# EAGLE design main (EAGLE 7.5.0)
COMPANY: ADAFRUIT INDUSTRIES; DRAWN: KTOWN; REV: B
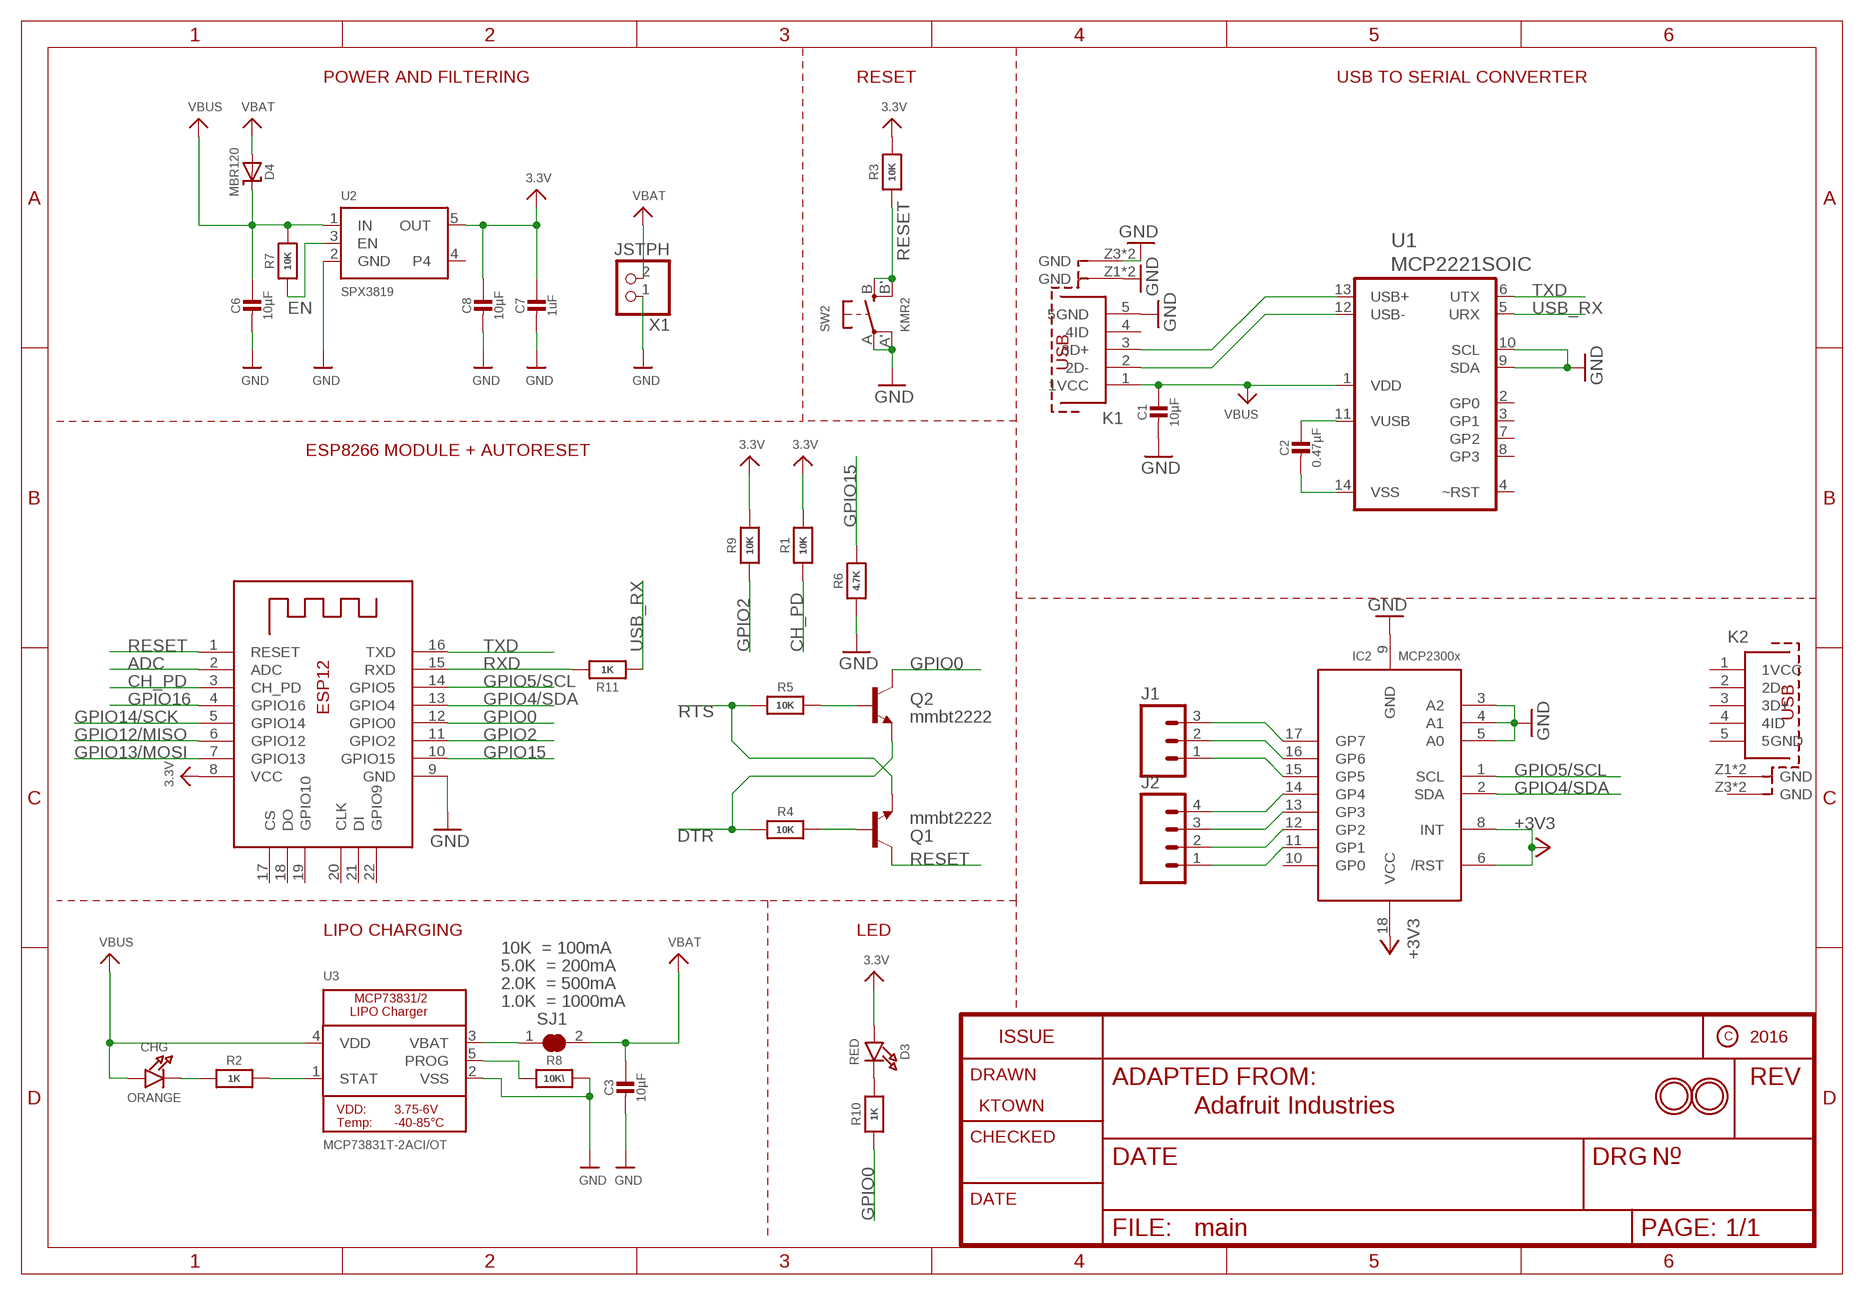
[diagram p0: schematic, sheet 1]
FRAME1 (FRAME_A4): COMPANY: Bilal Mahmoud; REV: .1

## Parts
C1  10µF  CAP_CERAMIC0805-NOOUTLINE  [0805-NO]
C2  0.47µF  CAP_CERAMIC0805-NOOUTLINE  [0805-NO]
C3  10µF  CAP_CERAMIC0805-NOOUTLINE  [0805-NO]
C6  10µF  CAP_CERAMIC0805-NOOUTLINE  [0805-NO]
C7  1uF  CAP_CERAMIC0603_NO  [0603-NO]
C8  10µF  CAP_CERAMIC0805-NOOUTLINE  [0805-NO]
CHG  ORANGE  LED0805_NOOUTLINE  [CHIPLED_0805_NOOUTLINE]
D3  RED  LED0805_NOOUTLINE  [CHIPLED_0805_NOOUTLINE]
D4  MBR120  DIODE-SCHOTTKYSOD-123  [SOD-123]
IC2  MCP23008/SO  [SO18W]
J1  M031X03_NO_SILK  [1X03_NO_SILK]
J2  M04NO_SILK_ALL_ROUND  [1X04_NO_SILK_ALL_ROUND]
K1  629105150521  [629105150521]
K2  629105150521  [629105150521]
Q1  mmbt2222  TRANSISTOR_NPNSOT23-3  [SOT23-3]
Q2  mmbt2222  TRANSISTOR_NPNSOT23-3  [SOT23-3]
R1  10K  RESISTOR_0603_NOOUT  [0603-NO]
R2  1K  RESISTOR_0603_NOOUT  [0603-NO]
R3  10K  RESISTOR_0603_NOOUT  [0603-NO]
R4  10K  RESISTOR_0603_NOOUT  [0603-NO]
R5  10K  RESISTOR_0603MP  [_0603MP]
R6  4.7K  RESISTOR_0603_NOOUT  [0603-NO]
R7  10K  RESISTOR_0603_NOOUT  [0603-NO]
R8  10K\  RESISTOR_0603_NOOUT  [0603-NO]
R9  10K  RESISTOR_0603_NOOUT  [0603-NO]
R10  1K  RESISTOR_0603_NOOUT  [0603-NO]
R11  1K  RESISTOR_0603MP  [_0603MP]
SJ1  SOLDERJUMPER_CLOSED  [SOLDERJUMPER_CLOSEDWIRE]
SW2  KMR2  SWITCH_TACT_SMT4.6X2.8  [BTN_KMR2_4.6X2.8]
U1  MCP2221SOIC  [SOIC14]
U2  SPX3819  VREG_SOT23-5  [SOT23-5]
U3  MCP73831T-2ACI/OT  MCP73831/2  [SOT23-5]
U$31  MOUNTINGHOLE2.5  [MOUNTINGHOLE_2.5_PLATED]
U$32  MOUNTINGHOLE2.5  [MOUNTINGHOLE_2.5_PLATED]
X1  JSTPH  CON_JST_PH_2PIN  [JSTPH2]
X2  ESP-12  ESP-12E  [ESP-12E]

## Nets
3.3V: C7.1 C8.1 D3.A R1.2 R3.2 R9.2 U2.5(OUT) X2.8(VCC)
+3V3: IC2.6(/RST) IC2.8(INT) IC2.18(VCC)
ADC: X2.2(ADC)
CH_PD: R1.1 X2.3(CH_PD)
DTR: Q2.2(E) R4.1
EN: R7.1 U2.3(EN)
GND: C1.2 C3.2 C6.2 C7.2 C8.2 IC2.3(A2) IC2.4(A1) IC2.5(A0) IC2.9(GND) K1.5(5GND) K1.Z1(GND) K1.Z2(GND) K1.Z3(GND) K1.Z4(GND) R6.1 R8.2 SW2.A'(P1) SW2.A(P) U1.9(SDA) U1.10(SCL) U2.2(GND) U3.2(VSS) X1.1 X2.9(GND)
GPIO0: Q2.3(C) R10.1 X2.12(GPIO0)
GPIO2: R9.1 X2.11(GPIO2)
GPIO4/SDA: IC2.2(SDA) X2.13(GPIO4)
GPIO5/SCL: IC2.1(SCL) X2.14(GPIO5)
GPIO12/MISO: X2.6(GPIO12)
GPIO13/MOSI: X2.7(GPIO13)
GPIO14/SCK: X2.5(GPIO14)
GPIO15: R6.2 X2.10(GPIO15)
GPIO16: X2.4(GPIO16)
N$1: CHG.C R2.1
N$2: C2.1 U1.11(VUSB)
N$3: R2.2 U3.1(STAT)
N$4: R8.1 U3.5(PROG)
N$5: D3.C R10.2
N$6: C2.2 U1.14(VSS)
N$7: SJ1.1 U3.3(VBAT)
N$8: K1.3(3D+) U1.13(USB+)
N$9: IC2.17(GP7) J1.3
N$10: IC2.16(GP6) J1.2
N$11: IC2.15(GP5) J1.1
N$12: Q1.1(B) R4.2
N$13: Q2.1(B) R5.2
N$14: IC2.14(GP4) J2.4
N$15: IC2.13(GP3) J2.3
N$16: IC2.12(GP2) J2.2
N$17: IC2.11(GP1) J2.1
N$18: K1.2(2D-) U1.12(USB-)
RESET: Q1.3(C) R3.1 SW2.B'(S1) SW2.B(S) X2.1(RESET)
RTS: Q1.2(E) R5.1
RXD: R11.2 X2.15(RXD)
TXD: U1.6(UTX) X2.16(TXD)
USB_RX: R11.1 U1.5(URX)
VBAT: C3.1 D4.A SJ1.2 X1.2
VBUS: C1.1 C6.1 CHG.A D4.C K1.1(1VCC) R7.2 U1.1(VDD) U2.1(IN) U3.4(VDD)
Unconnected: IC2.10(GP0) K1.4(4ID) K2.1(1VCC) K2.2(2D-) K2.3(3D+) K2.4(4ID) K2.5(5GND) K2.Z1(GND) K2.Z2(GND) K2.Z3(GND) K2.Z4(GND) U1.2(GP0) U1.3(GP1) U1.4(~RST) U1.7(GP2) U1.8(GP3) U2.4 X2.17(CS) X2.18(DO) X2.19(GPIO10) X2.20(CLK) X2.21(DI) X2.22(GPIO9)

## Notes on the sheet
- POWER AND FILTERING | RESET | USB TO SERIAL CONVERTER
- ESP8266 MODULE + AUTORESET
- LIPO CHARGING | LED
- 10K  = 100mA
- 5.0K  = 200mA
- 2.0K  = 500mA
- 1.0K  = 1000mA

## Library data of the parts
C1-C3 C6-C8 = microbuilder:CAP_CERAMIC: Ceramic Capacitors For new designs, use the packages preceded by an '_' character since they are more reliable: The following footprints should be used on most boards: _0402 - Standard footprint for regular board layouts _0603 - Standard footprint for regular board layouts _0805 - Standard footprint for regular board layouts _1206 - Standard footprint for regular board layouts For extremely tight-pitch boards where space is at a premium, the following 'micro-pitch' footprints can be used (smaller pads, no silkscreen outline, etc.): _0402MP - Micro-pitch footprint for very dense/compact boards _0603MP - Micro-pitch footprint for very dense/compact boards _0805MP - Micro-pitch footprint for very dense/compact boards _1206MP - Micro-pitch footprint for very dense/compact boards
CHG D3 = microbuilder:LED: LED 0603 - 0603 Surface Mount Package 2mA: Green LED - Low Power (3.9mcd, 2ma, 1.7Vf) - Digikey: 475-2709-2-ND Orange LED - Low Power (9.8mcd, 2ma, 1.8Vf) - Digikey: 475-1194-2-ND Red LED - Low Power (5mcd, 2ma, 1.8Vf) - Digikey: 475-1195-2-ND Yellow LED - Low Power (7mcd, 2ma, 1.8Vf) - Digikey: 475-1196-2-ND 5mA: Blue LED - Low Power (17mcd, 5ma, 2.9Vf) - Digikey: LNJ937W8CRACT-ND 0805 - 0805 Surface Mount Package 2mA: Red LED (8.8mcd, 2mA, 1.8Vf, Clear) - Low Power [Digikey: 475-2510-1-ND] Green LED (5mcd, 2mA, 1.8Vf, Clear) - Low Power [Digikey: 475-2730-1-ND] Yellow LED (11.3mcd, 2mA, 1.8Vf, Clear) - Low Power [Digikey: 475-2555-1-ND] 20mA: Red LED (104mcd, 20mA, Diffused) - LS R976 [Digikey: 475-1278-6-ND] Red LED (12mcd, 20mA, 2.0Vf, Clear) - APT2012EC [Digikey: 754-1128-1-ND] Green LED (15mcd, 20mA, 2.2Vf, Clear) - APT2012GC [Digikey: 754-1131-1-ND] Orange LED (160mcd, 20mA, 2.1Vf, Clear) - APT2012SECK [Digikey: 754-1130-1-ND] 1206 - 1206 Surface Mount Package Green LED (26mcd, 20mA, Diffused) - LG N971 [Digikey: 475-1407-6-ND] Red LED (15mcd, 20mA, Diffused) - LH N974 [Digikey: 475-1416-6-ND] Cree - Cree High-Power Surface Mount LEDs XPEBWT-L1-0000-00D50 - White 111lm 350mA 2.9Vf 6200K 110° XTEAWT-00-0000-00000LEE3 - White 114lm 350mA 2.85Vf 5000K 115° Everlight - Everlight 45-21 Series Surface Mount LEDs 45-21/QK2C-B2832AC2CB2/2T - Warm White 2000mcd 20mA 3.25Vf 3050K 120° 45-21/LK2C-B38452C4CB2/2T - Nuetral White 2000mcd 20mA 3.25Vf 4150K 120° 45-21/LK2C-B50634C6CB2/2T - Cold White 2200mcd 20mA 3.25Vf 5650K 120° PLCC2 Reverse Mount LS T77K-J1L2-1-0-2-R18-Z - Red 11.25mcd 2mA 1.8Vf 630nm 120° LO T77K-L1M2-24-Z - Orange 19.6mcd 2mA 1.8Vf 606nm 120° LY T77K-K2M1-26-Z - Yellow 15.7mcd 2mA 1.8Vf 587nm 120°
D4 = microbuilder:DIODE-SCHOTTKY
IC2 = adafruit:MCP23008: MCP23008 Inexpensive i2c i/o expander - 8 general purpose i/o pins with optional pullups
J1 = SparkFun-Connectors:M03: Header 3 Standard 3-pin 0.1" header. Use with straight break away headers (SKU : PRT-00116), right angle break away headers (PRT-00553), swiss pins (PRT-00743), machine pins (PRT-00117), and female headers (PRT-00115). Molex polarized connector foot print use with SKU : PRT-08232 with associated crimp pins and housings.
J2 = SparkFun-Connectors:M04: Header 4 Standard 4-pin 0.1" header. Use with straight break away headers (SKU : PRT-00116), right angle break away headers (PRT-00553), swiss pins (PRT-00743), machine pins (PRT-00117), and female headers (PRT-00115). Molex polarized connector foot print use with SKU : PRT-08231 with associated crimp pins and housings. 1MM SMD Version SKU: PRT-10208; PROD_ID: CONN-09696
K1 K2 = Input-Output_Connectors_rev15d:629105150521: WR-COM_USB_Micro Type B_Horizontal_SMT ; Micro Type B Horizontal SMT - 3A current at Pin1 & Pin 5 - with Pegs and THT shielding Pins - T&R Packaging Code : Con_I-O_COM_USB_2.0_B_629105150521_629105150521 <http://katalog.we-online.de/media/images/eican/Con_I-O_COM_USB_2.0_B_629105150521_pf2.jpg> Details see: http://katalog.we-online.de/em/datasheet/629105150521.pdf Created 12/08/2014, Dan Xu 2014 (C) Wurth Elektronik
Q1 Q2 = SparkFun:TRANSISTOR_NPN: Transistor NPN BJT configuration in SOT23 package. MMBT2222 is the common NPN we use. Double check BCE configuration again layout.
R1-R11 = microbuilder:RESISTOR: Resistors For new designs, use the packages preceded by an '_' character since they are more reliable: The following footprints should be used on most boards: _0402 - Standard footprint for regular board layouts _0603 - Standard footprint for regular board layouts _0805 - Standard footprint for regular board layouts _1206 - Standard footprint for regular board layouts For extremely tight-pitch boards where space is at a premium, the following 'micro-pitch' footprints can be used (smaller pads, no silkscreen outline, etc.): _0402MP - Micro-pitch footprint for very dense/compact boards _0603MP - Micro-pitch footprint for very dense/compact boards _0805MP - Micro-pitch footprint for very dense/compact boards _1206MP - Micro-pitch footprint for very dense/compact boards
SJ1 = microbuilder:SOLDERJUMPER_CLOSED: Solder Jumper - Closed These solder jumpers are closed by default CLOSEDWIRE - 10 mil trace between pads that can be cut and resoldered later CLOSEDPERM - 63 mil trace between pads for a permanent connection (used to 'bridge' two signals, a shameless hack for Eagle). Can double as a test point as well (no cream layer)
SW2 = microbuilder:SWITCH_TACT_SMT: SMT Tact Switches 6x6mm - Digikey: P12940SCT-ND KMR2 (4.6x2.8mm) - Digikey: 401-1426-1-ND EVQ-PQHB55 - Light Touch, 160GF (4.5x4.5mm) - Digikey: P8090SCT-ND KMT0 - KMT021 NGJ LHS (etc.) IP68/Waterproof - Digikey: CKN10289CT-ND
U1 = mcp2221:MCP2221
U2 = microbuilder:VREG_SOT23-5: SOT23-5 Fixed Voltage Regulators Part Current Out V Out V In V Dropout ?JA (°C/W) TJ (°C) Digikey Part No. ADP121 150mA 3.3V 3.4-5.5V 0.09V @ 150mA -- -- ADP121-AUJZ33R7CT-ND ADP121 150mA 3.0V 3.1-5.5V 0.09V @ 150mA -- -- ADP121-AUJZ30R7CT-ND ADP122 300mA 3.3V 3.4-5.5V 0.085V @ 300mA -- -- ADP122AUJZ-3.3-R7CT-ND ADP1712 300mA 3.3V 3.5-5.5V 0.17V @ 300mA -- -- ADP1712AUJZ-3.3-R7TR-ND AP7311 (Low Cost) 150mA 3.3V 3.5-6V 0.15V @ 150mA -- -- AP7311-33WG-7DICT-ND LD39015M18R 150mA 1.8V 1.9V-5.5V 0.08V @ 100mA -- -- 497-6977-1-ND LP2985A-33DBVR 150mA 3.3V 3.3-16V 0.28V @ 150mA 206 150 296-18479-1-ND MCP1824T-3302E/OT 300mA 3.3V 3.5V-6V 0.2V @ 300mA -- -- MCP1824T-3302E/OTCT-ND MIC5205-2.5YM5 TR 150mA 2.5V 2.7-16V 0.165V @ 150mA -- -- 576-1257-2-ND MIC5205-3.0YM5 TR 150mA 3.0V 3.2V-16V 0.165V @ 150mA -- -- 576-1258-2-ND MIC5205-3.3YM5 TR 150mA 3.3V 3.5V-16V 0.165V @ 150mA -- -- 576-1259-2-ND TPS780330220 150mA 3.3V+2.2V 3.6-5.5V 250mV Max -- -- 296-23332-1-ND TDA3663/N1,135 100mA 3.3V 3.5-45V 0.18V @ 50mA -- -- 568-5343-1-ND Max operating temp can be calculated using ?JA, TJ (max junction temperature), and power in watts. Set the "Maximum Ambient Temperature" until it reaches TJ ("Max Junction Temperature"), which is the absolute limit for safe use of the regulator: Heat Sink Temperature Calculator <http://www.daycounter.com/Calculators/Heat-Sink-Temperature-Calculator.phtml> For example, With 12V source into a 3.3V LP2985 and a 30mA load, we are dissipating (12V-3.3V) * 0.03A = 0.261W. With a ?JA of 206 °C/W, a TJ of 150°C, and 261mW we can safely use the chip without a heat sink up to 75°C (=147.1°C Junction Temperature).
U3 = microbuilder:MCP73831/2: MCP73831/2 LIPO Charger VDD: 3.75 - 6V Temp -40 - 85°C Programmable Charge Rate: 15-500mA NOTE: STAT is a tri-state logic output on the MCP73831 and an open-drain output on the MCP73832. SOT23-5 with 4.2V output and tri-state logic on STAT = MCP73831T-2ACI/OT
U$31 U$32 = microbuilder:MOUNTINGHOLE: Mounting Hole For #2 screws (0.086"/2.18mm width, 0.094"/2.4mm hole) use 2.5mm; BOM: EXCLUDE
X1 = microbuilder:CON_JST_PH_2PIN: JST 2-Pin Right-Angle Connector PH-Series - 4UConnector: 17311 SH-Series - 4UConnector: 07278
X2 = microbuilder:ESP-12E

## Board
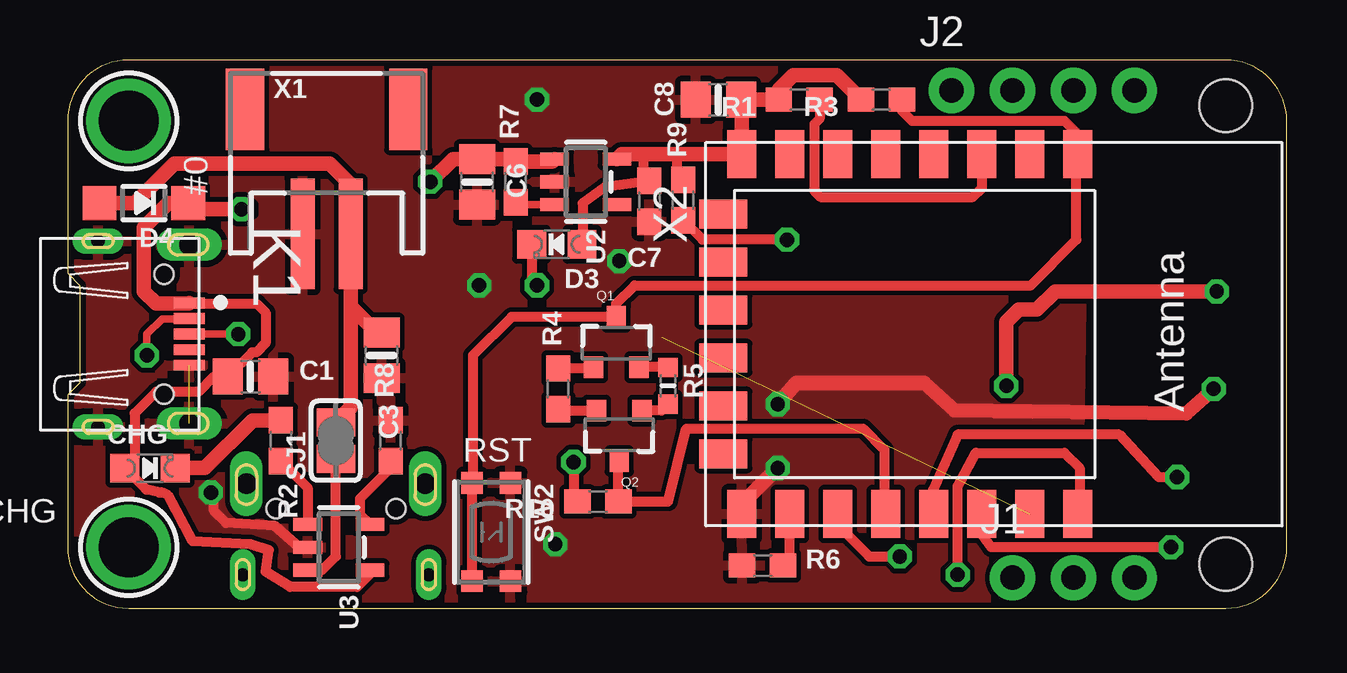
[diagram p1: board, top side]
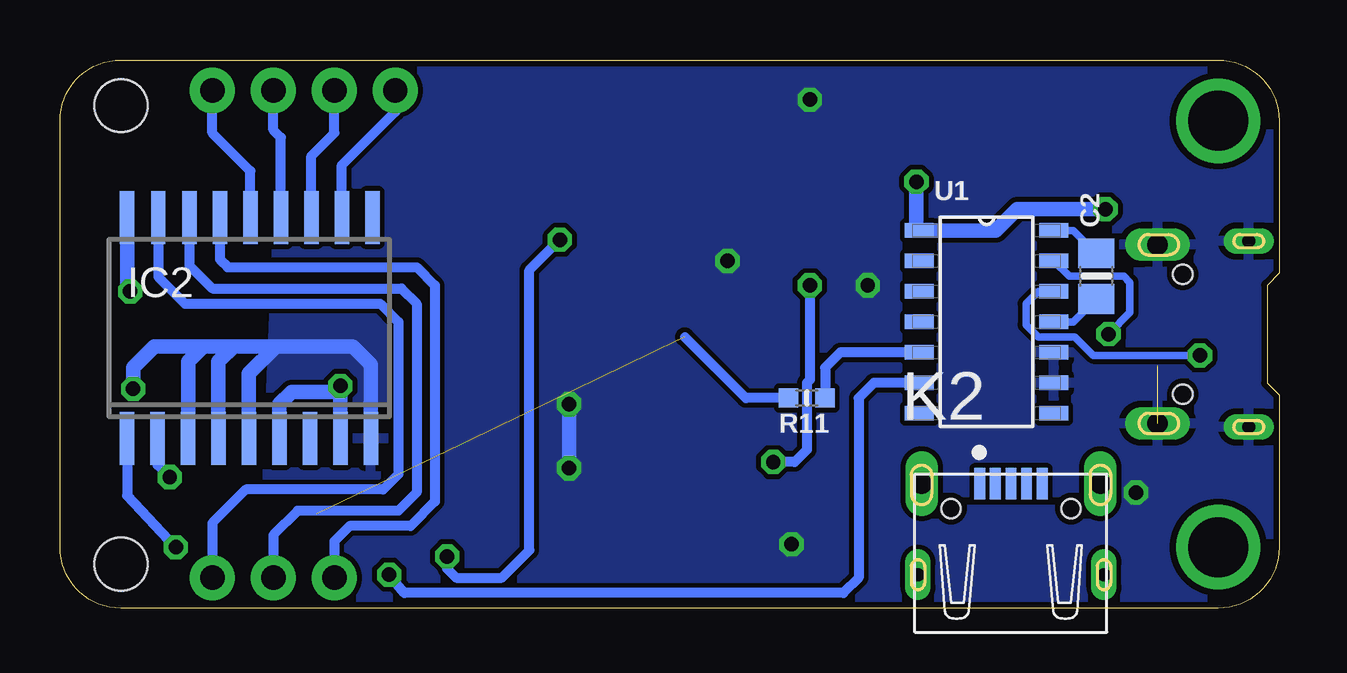
[diagram p2: board, bottom side, seen from below]

Size 50.8 x 22.86 mm. Coordinates in mm from the lower left corner, seen from the top.
Outline: 2.54,0 48.26,0 arc90 50.8,2.54 50.8,20.32 arc90 48.26,22.86 2.54,22.86 arc90 0,20.32 0,13.97 0.51,13.46 0.51,9.4 0,8.89 0,2.54 arc90 2.54,0
Copper layers (1*16): Top 0.035mm / dielectric 1.5mm / Bottom 0.035mm
Design rules "adafruit *": minimum track width 8mil, minimum drill 15.5mil, track to track 8mil, track to pad 8mil, pad to pad 8mil, via to via 8mil, smd to smd 8mil, copper to edge 10mil, drill to drill 8mil, minimum pad ring 10mil, minimum via ring 8mil, stop-mask expansion 2mil, vias tented up to drill 20mil, thermal gap 10mil
Holes 2.2 mm at 48.26,1.84 48.26,20.95

### Footprints (pad centres in the part's own frame; a part is rotated, then mirrored left to right if it is on the bottom)
0805-NO = smd 1.24 x 1.5: 1 -0.95,0; 2 0.95,0
0603-NO = smd 1.1 x 1: 1 -0.85,0; 2 0.85,0
CHIPLED_0805_NOOUTLINE = smd 1.2 x 1.2: A 0,-1.05; C 0,1.05
SOD-123 = smd 1.4 x 1.4: A 1.85,0; C -1.85,0
SO18W = smd 0.6 x 2.2: 1 -4.445,-4.6; 2 -3.175,-4.6; 3 -1.905,-4.6; 4 -0.635,-4.6; 5 0.635,-4.6; 6 1.905,-4.6; 7 3.175,-4.6; 8 4.445,-4.6; 9 5.715,-4.6; 10 5.775,4.6; 11 4.505,4.6; 12 3.235,4.6; 13 1.965,4.6; 14 0.695,4.6; 15 -0.575,4.6; 16 -1.845,4.6; 17 -3.145,4.6; 18 -4.445,4.6
1X03_NO_SILK = drill 1.016 pad 1.88: 1 0,0; 2 2.54,0; 3 5.08,0
1X04_NO_SILK_ALL_ROUND = drill 1.016 pad 1.88: 1 0,0; 2 2.54,0; 3 5.08,0; 4 7.62,0
629105150521 = smd 0.45 x 1.3: 1 -1.3,3.8; 2 -0.65,3.8; 3 0,3.8; 4 0.65,3.8; 5 1.3,3.8 | drill 0.85 pad 1.2 long: Z1 -3.725,3.8; Z2 3.725,3.8 | drill 0.55 pad 0.9 long: Z3 3.875,0; Z4 -3.875,0 | hole 0.8: -2.5,2.75; 2.5,2.75
SOT23-3 = smd 0.8 x 0.9: 1 -0.95,-1; 2 0.95,-1; 3 0,1.1
_0603MP = smd 0.8 x 0.8: 1 -0.762,0; 2 0.762,0
SOLDERJUMPER_CLOSEDWIRE = smd 1.168 x 1.6: 1 -0.762,0; 2 0.762,0 | smd 0.635 x 0.203: WIRE 0,0
BTN_KMR2_4.6X2.8 = smd 0.9 x 0.9: A 2.05,0.8; A' -2.05,0.8; B 2.05,-0.8; B' -2.05,-0.8
SOIC14 = smd 1.2 x 0.6: 1 -2.8,3.81; 2 -2.8,2.54; 3 -2.8,1.27; 4 -2.8,0; 5 -2.8,-1.27; 6 -2.8,-2.54; 7 -2.8,-3.81; 8 2.8,-3.81; 9 2.8,-2.54; 10 2.8,-1.27; 11 2.8,0; 12 2.8,1.27; 13 2.8,2.54; 14 2.8,3.81
SOT23-5 = smd 0.55 x 1.2: 1 -0.95,-1.3; 2 0,-1.3; 3 0.95,-1.3; 4 0.95,1.3; 5 -0.95,1.3
MOUNTINGHOLE_2.5_PLATED = drill 2.5 pad 3.2: P$1 0,0
JSTPH2 = smd 1 x 4.6: 1 -1,-3.7; 2 1,-3.7 | smd 1.6 x 3.4: NC1 -3.4,1.5; NC2 3.4,1.5
ESP-12E = smd 2 x 1.2: 1 -7.5,5.77; 2 -7.5,3.77; 3 -7.5,1.77; 4 -7.5,-0.23; 5 -7.5,-2.23; 6 -7.5,-4.23; 7 -7.5,-6.23; 8 -7.5,-8.23; 9 7.5,-8.23; 10 7.5,-6.23; 11 7.5,-4.23; 12 7.5,-2.23; 13 7.5,-0.23; 14 7.5,1.77; 15 7.5,3.77; 16 7.5,5.77 | smd 1.2 x 2: 17 -5,-9; 18 -3,-9; 19 -1,-9; 20 1,-9; 21 3,-9; 22 5,-9

### Placement (x,y rotation side)
C1  7.62,9.65 0 top
C2  7.62,13.84 90 bottom
C3  13.08,10.54 270 top
C6  17.06,17.77 270 top
C7  24.24,16.97 270 top
C8  27.12,21.19 180 top
CHG  3.43,5.84 270 top
D3  20.38,15.18 90 top
D4  3.17,16.89 180 top
IC2  43.56,11.68 0 bottom
J1  39.37,1.27 0 top
J2  36.83,21.59 0 top
K1  1.27,11.43 270 top
K2  11.18,1.4 0 bottom
Q1  22.86,11.05 0 top
Q2  22.99,7.24 180 top
R1  30.48,21.21 180 top
R2  8.89,6.99 270 top
R3  33.91,21.21 180 top
R4  20.45,9.14 90 top
R5  25.02,9.27 270 top
R6  28.96,1.78 0 top
R7  18.67,17.78 90 top
R8  13.46,6.99 90 top
R9  25.65,17.02 90 top
R10  22.1,4.45 180 top
R11  19.68,8.76 180 bottom
SJ1  11.18,6.99 90 top
SW2  17.65,3.17 270 top
U1  12.19,11.94 0 bottom
U2  21.59,17.78 270 top
U3  11.3,2.54 270 top
U$31  2.54,20.32 270 top
U$32  2.54,2.54 270 top
X1  10.79,19.3 0 top
X2  36.32,11.43 270 top

### Tracks (layer width: path | path; a pad name or v marks a point on that pad's centre or on a via)
3.3V
  Top 0.406: 24,18.93 24,18.05 C7.1 22.39,17.56 21.46,16.89 21.46,15.21 D3.A | R9.2 25.4,18.12 25.4,18.93
  Top 0.61: U2.5 23.09,18.93 24,18.93 25.4,18.93 X2.8 28.09,21.17 C8.1 28.08,21.21 R1.2 29.63,21.63 30.23,22.23 32.04,22.23 R3.2
+3V3  (via drill 0.6)
  Top 0.61: v47.88,13.21 41.15,13.21 40.39,12.45 39.62,12.45 39.12,11.94 v39.12,9.27
  Bottom 0.61: IC2.18 48.01,13.34 v47.88,13.21 | IC2.8 v39.12,9.27 39.37,9.02 41.15,9.02 41.66,8.51 IC2.6
CH_PD
  Top 0.406: R1.1 31.33,20.41 31.11,20.19 31.11,17.4 31.37,17.14 37.72,17.14 38.1,17.53 X2.3
DTR
  Top 0.406: R4.1 20.5,8.24 Q2.2
EN
  Top 0.305: R7.1 18.77,16.83 U2.3
GND  (via drill 0.6)  (1 unrouted)
  Top 0.406: U3.2 9.65,2.54 8.64,3.43 6.6,3.56 6.1,4.06 6.1,4.7 v5.97,4.83 | 9.78,15.59 X1.1
  Top 0.61: X2.9 28.09,4.34 v29.59,5.84 | v29.59,8.51 30.35,9.4 35.69,9.4 36.96,8.26 46.61,8.13 v47.75,9.14
  Bottom 0.61: IC2.3 45.47,10.29 44.83,10.92 | 44.83,10.92 43.56,10.92 | 43.56,10.92 41.78,10.92 | 41.78,10.92 38.61,10.92 37.85,10.16 IC2.9 | IC2.4 44.2,10.29 43.56,10.92 | IC2.5 42.93,9.78 41.78,10.92 | v29.59,5.84 v29.59,8.51 | v47.75,9.14 47.75,10.03 46.86,10.92 44.83,10.92
  other vias: 20.32,2.67 17.14,13.46 19.56,21.21 22.99,14.48
  pour Bottom: 1.65,22.99 41.66,24.26 41.53,21.46 42.42,-0.64 -0.13,-1.27 -1.65,23.75
  pour Top: -1.02,23.5 42.42,25.15 42.04,-1.27 0.25,-0.89
GPIO0
  Top 0.406: Q2.3 22.95,6.1 R10.1 25.02,4.45 25.78,7.49 33.15,7.49 34.04,6.6 34.04,3.99 X2.12
GPIO2  (via drill 0.6)
  Top 0.406: X2.11 32.09,3.47 33.4,2.16 v34.67,2.16 | v29.97,15.37 26.45,15.37 R9.1
  Bottom 0.406: v34.67,2.16 34.67,1.65 34.29,1.27 32.38,1.27 31.24,2.41 31.24,14.1 v29.97,15.37
GPIO4/SDA  (via drill 0.6)
  Top 0.406: v46.23,5.46 45.47,5.46 43.81,7.24 37.08,7.24 36.07,4.95 36.07,3.95 X2.13
  Bottom 0.406: IC2.2 46.74,5.97 v46.23,5.46
GPIO5/SCL  (via drill 0.6)
  Top 0.406: v45.97,2.54 38.48,2.54 38.1,3.05 X2.14
  Bottom 0.406: IC2.1 48.01,4.7 v45.97,2.54
GPIO15
  Top 0.406: R6.2 30.09,2.06 X2.10
N$1
  Top 0.61: CHG.C 5.71,5.84 7.71,7.83 R2.1
N$2
  Bottom 0.305: C2.1 8.57,11.94 U1.11
N$3
  Top 0.406: R2.2 10,5.02 U3.1
N$4
  Top 0.406: U3.5 12.19,3.9 12.19,4.57 13.46,5.84 R8.1
N$5  (via drill 0.6)
  Top 0.406: D3.C 19.33,13.69 v19.56,13.46 | v21.08,6.1 21.08,4.61 R10.2
  Bottom 0.406: v19.56,13.46 19.56,9.53 19.68,9.4 19.68,6.6 20.19,6.1 v21.08,6.1
N$6
  Bottom 0.305: C2.2 8.57,15.75 U1.14
N$7
  Top 0.406: U3.3 10.61,1.59 11.18,2.16 SJ1.1
N$8  (via drill 0.6)
  Top 0.305: v7.11,11.43 K1.3
  Bottom 0.305: U1.13 8.76,13.84 6.48,13.84 6.22,13.59 6.22,12.32 v7.11,11.43
N$9
  Bottom 0.406: IC2.17 46.71,13.81 45.59,12.7 37.47,12.7 36.7,11.94 36.7,5.59 37.34,4.95 43.05,4.95 44.45,3.56 J1.3
N$10
  Bottom 0.406: IC2.16 45.41,14.29 44.45,13.34 36.58,13.34 35.94,12.7 35.94,4.83 36.7,4.06 40.89,4.06 41.91,3.05 J1.2
N$11
  Bottom 0.406: IC2.15 44.14,14.54 43.81,14.22 35.94,14.22 35.18,13.46 35.18,4.45 36.2,3.43 38.73,3.43 39.37,2.79 J1.1
N$12
  Top 0.406: Q1.1 21.86,9.99 R4.2
N$13
  Top 0.406: R5.2 24.75,8.24 Q2.1
N$14
  Bottom 0.406: IC2.14 42.87,18.23 44.45,19.81 J2.4
N$15
  Bottom 0.406: IC2.13 41.6,19.62 41.91,19.94 J2.3
N$16
  Bottom 0.406: IC2.12 40.33,18.86 39.37,19.81 J2.2
N$17
  Bottom 0.406: IC2.11 39.06,18.48 36.83,20.7 J2.1
N$18  (via drill 0.6)
  Top 0.305: v3.3,10.54 3.3,11.43 3.94,12.06 5.05,12.06 K1.2
  Bottom 0.305: U1.12 10.03,13.21 10.54,12.7 10.54,11.81 10.03,11.3 8.51,11.3 7.75,10.54 v3.3,10.54
RESET
  Top 0.406: R3.1 34.76,20.74 35.18,20.32 41.53,20.32 42.16,19.68 42.16,19 X2.1 42.04,18.88 42.04,15.37 40.13,13.46 23.62,13.46 22.86,12.7 Q1.3 18.5,12.15 16.89,10.54 16.89,5.26 SW2.B' SW2.B
RTS
  Top 0.406: R5.1 25,10.05 Q1.2
RXD  (1 unrouted)
  Bottom 0.406: R11.2 22.23,8.76 24.77,11.3
TXD  (via drill 0.6)
  Top 0.406: v37.08,1.4 37.08,5.08 37.85,6.48 41.53,6.48 42.16,5.84 42.16,4 X2.16
  Bottom 0.406: U1.6 16.89,9.4 17.53,8.76 17.53,1.27 18.16,0.64 36.45,0.64 v37.08,1.4
USB_RX
  Bottom 0.406: U1.5 18.29,10.67 18.92,10.03 R11.1
VBAT
  Top 0.61: D4.A 2.79,16.89 4.45,18.54 10.92,18.54 11.79,17.67 X1.2 11.79,12.57 | SJ1.2 11.79,8.37 11.79,12.57 | C3.1 12.88,11.49 11.79,12.57
VBUS  (via drill 0.6)
  Top 0.406: U3.4 12.6,1.43 12.06,0.89 9.27,0.89 8.26,1.52 8.38,2.41 7.62,2.67 5.21,2.79 4.19,4.7 3.94,4.83 3.81,4.83 3.27,4.95 CHG.A 2.79,6.26 2.79,8.13 3.68,9.02 5.46,9.02 6.1,9.65 C1.1 7.69,10.67 7.87,10.67 8.26,11.05 8.26,12.32 7.87,12.7 5.04,12.7
  Top 0.61: K1.1 5.04,12.7 3.68,12.7 3.17,13.21 3.17,15.88 4.19,16.89 D4.C 5.28,16.64 v7.24,16.64 | U2.1 20.19,18.63 R7.2 18.57,18.73 C6.1 16.06,18.73 v15.11,17.78
  Bottom 0.61: v7.24,16.64 10.92,16.64 11.81,15.75 U1.1 15.11,15.87 v15.11,17.78

### Text on the board
tPlace: huzzah! | #0 | RST | CHG